# Altium schematic sheet Whitespace_Daughtercard_connector.SchDoc: Daughtercard HSMC Connector & Signals
size A2; Author: Ryan E. Guerra; Revision: 1.0; SheetNumber: 3; SheetTotal: 10
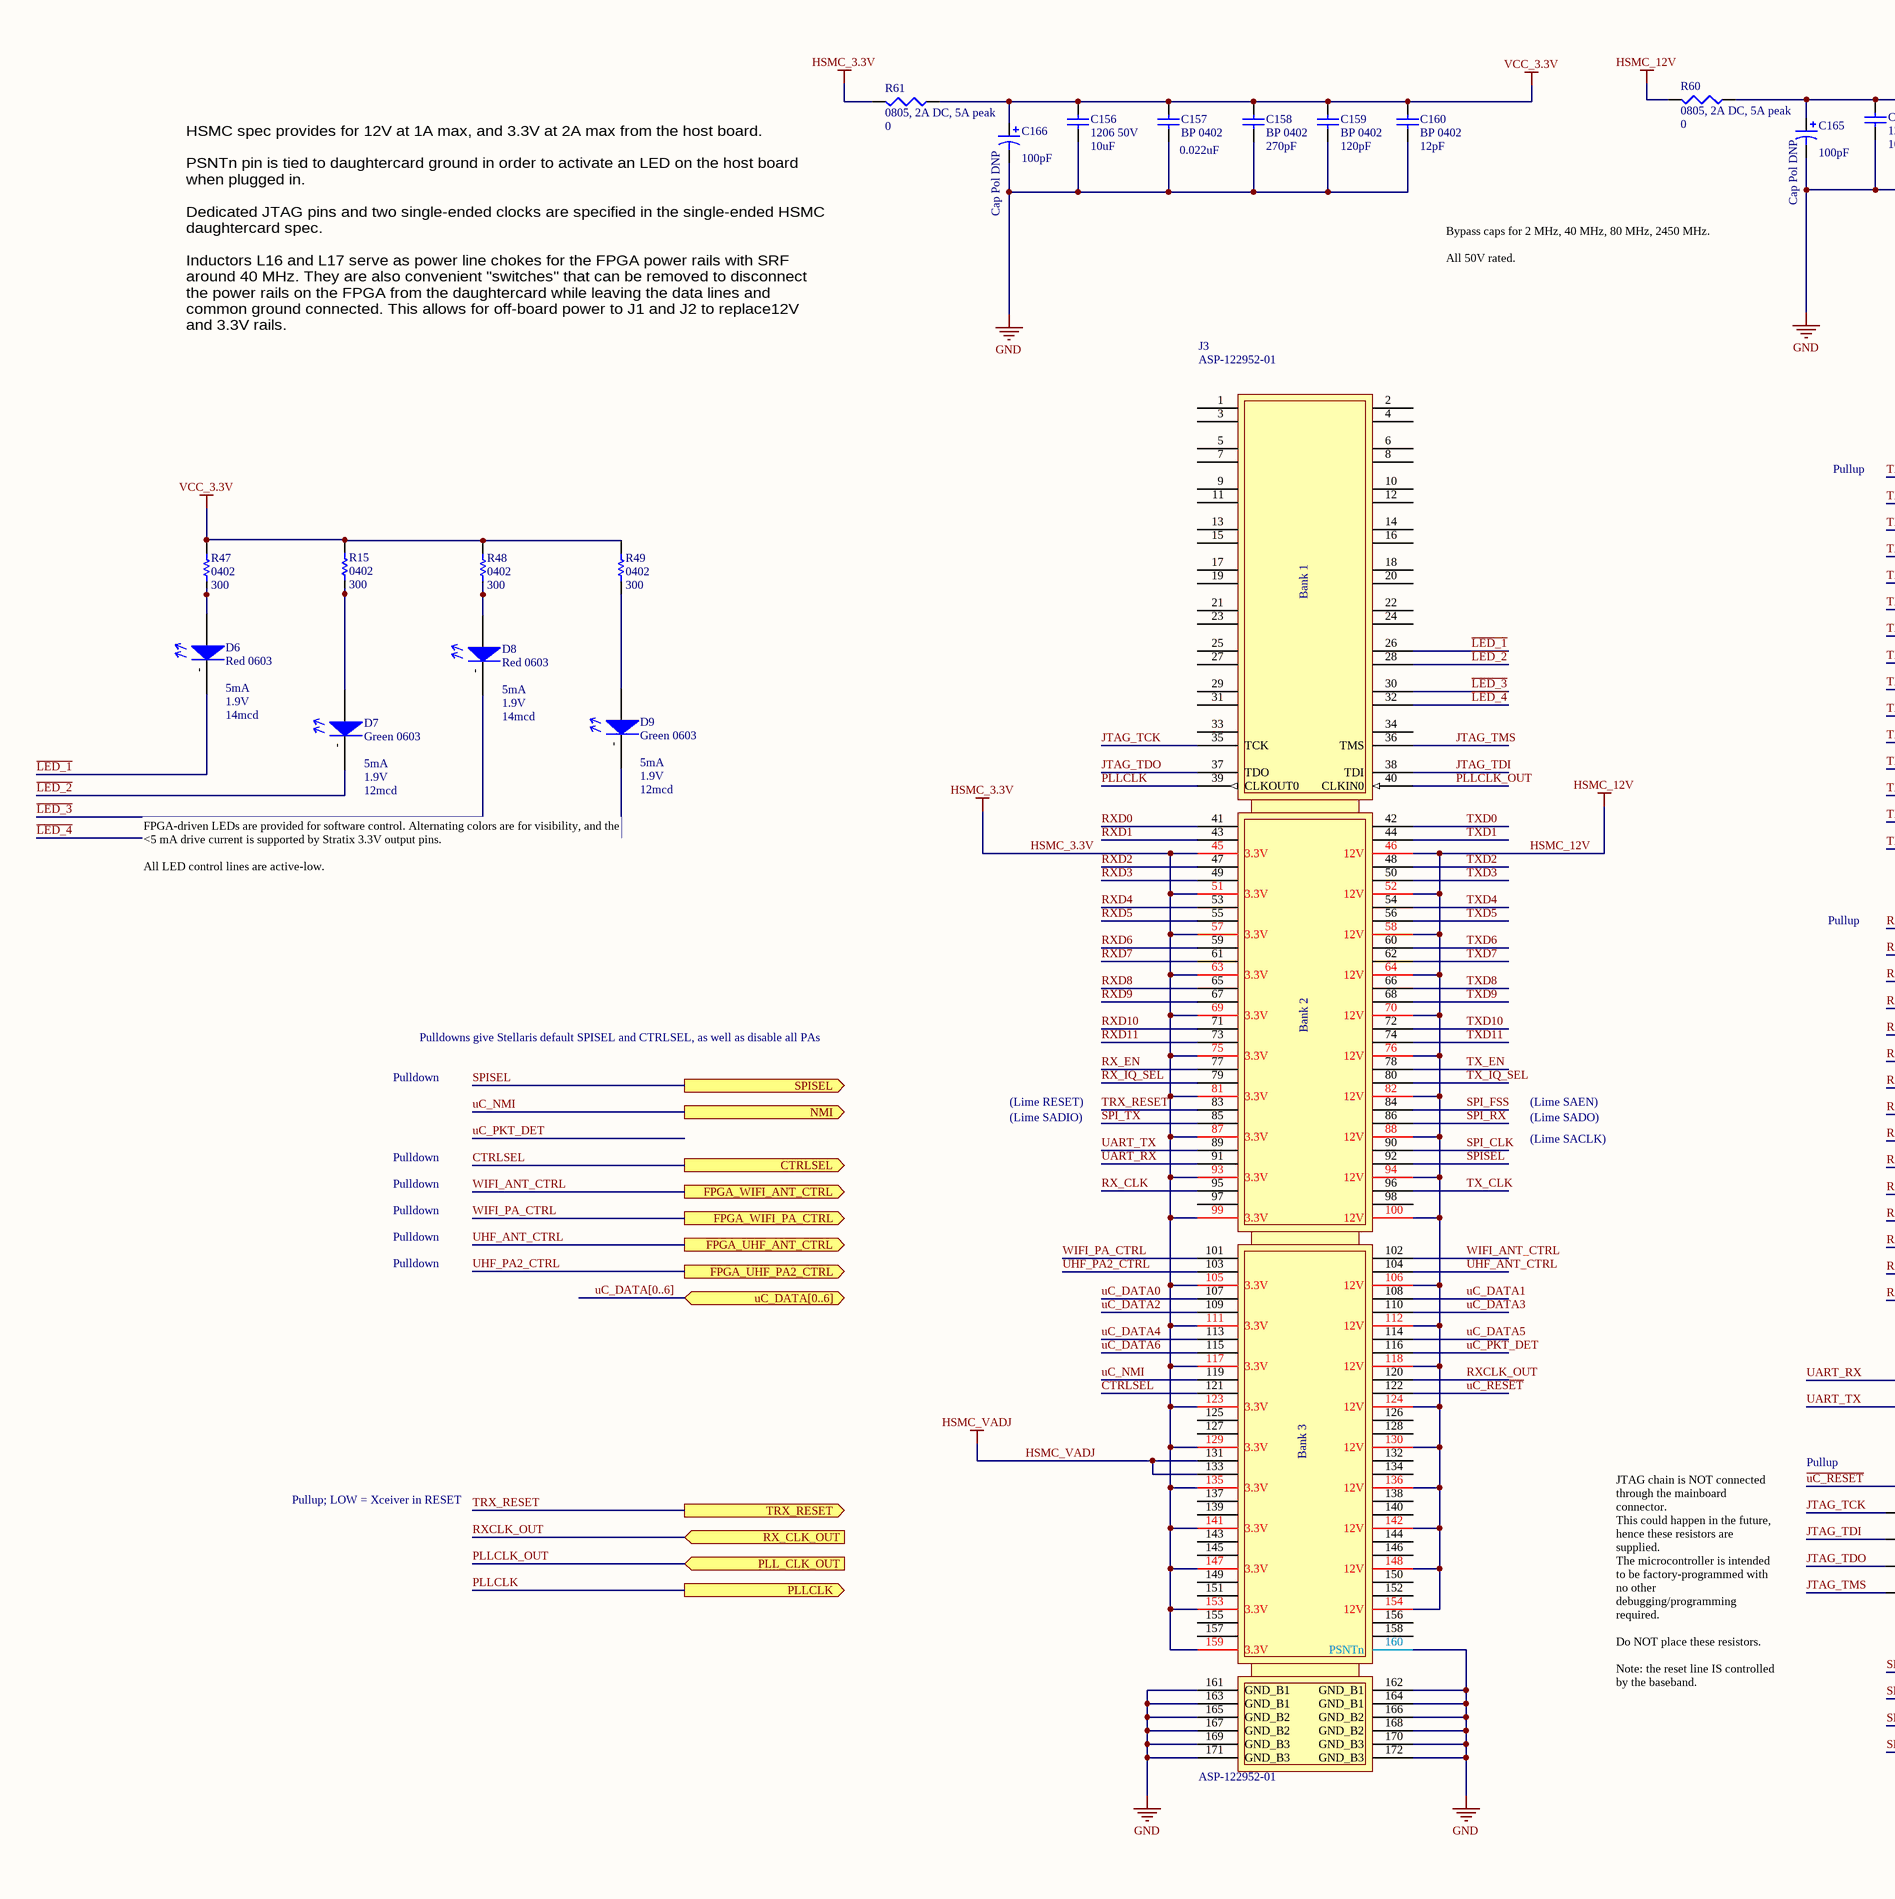
[diagram p0: Whitespace_Daughtercard_connector.SchDoc, left]
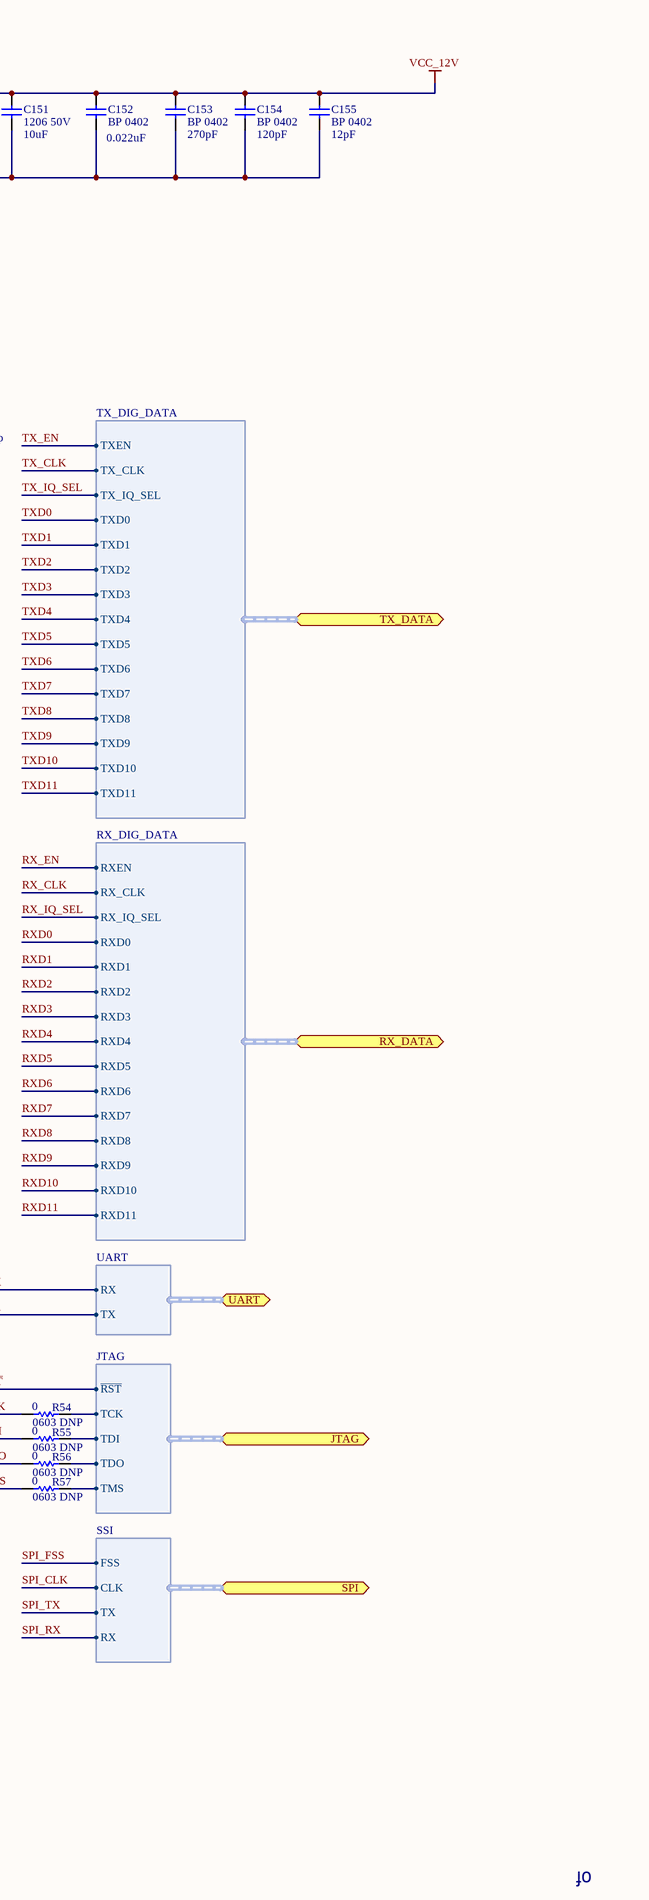
[diagram p1: Whitespace_Daughtercard_connector.SchDoc, right]

## Parts
C151  1206 50V  value 10uF  [1206_SMT_v3]
C152  BP 0402  value 0.022uF  [0402_SMT_V3]
C153  BP 0402  value 270pF  [0402_SMT_v3]
C154  BP 0402  value 120pF  [0402_SMT_v3]
C155  BP 0402  value 12pF  [0402_SMT_v3]
C156  1206 50V  value 10uF  [1206_SMT_v3]
C157  BP 0402  value 0.022uF  [0402_SMT_V3]
C158  BP 0402  value 270pF  [0402_SMT_v3]
C159  BP 0402  value 120pF  [0402_SMT_v3]
C160  BP 0402  value 12pF  [0402_SMT_v3]
C165  Cap Pol DNP  value 100pF  [PANASONIC_ELEC_CAP_G_v2]
C166  Cap Pol DNP  value 100pF  [PANASONIC_ELEC_CAP_G_v2]
D6  Red 0603  Current: 5mA  Forward Voltage Drop: 1.9V  Luminosity: 14mcd  [0603_POLAR]
D7  Green 0603  Current: 5mA  Forward Voltage: 1.9V  Luminosity: 12mcd  [0603_POLAR]
D8  Red 0603  Current: 5mA  Forward Voltage Drop: 1.9V  Luminosity: 14mcd  [0603_POLAR]
D9  Green 0603  Current: 5mA  Forward Voltage: 1.9V  Luminosity: 12mcd  [0603_POLAR]
J3  ASP-122952-01  [ASP-122952-01]
R15  0402  value 300  [0402_SMT_v3]
R47  0402  value 300  [0402_SMT_v3]
R48  0402  value 300  [0402_SMT_v3]
R49  0402  value 300  [0402_SMT_v3]
R54  0603 DNP  value 0  [0603_SMT_v3]
R55  0603 DNP  value 0  [0603_SMT_v3]
R56  0603 DNP  value 0  [0603_SMT_v3]
R57  0603 DNP  value 0  [0603_SMT_v3]
R60  0805, 2A DC, 5A peak  value 0  [0805_SMT_v3]
R61  0805, 2A DC, 5A peak  value 0  [0805_SMT_v3]

## Ports
CTRLSEL (out), FPGA_UHF_ANT_CTRL (out), FPGA_UHF_PA2_CTRL (out), FPGA_WIFI_ANT_CTRL (out), FPGA_WIFI_PA_CTRL (out), JTAG (harness JTAG), NMI (out), PLL_CLK_OUT (in), PLLCLK (out), RX_CLK_OUT (in), RX_DATA (harness RX_DIG_DATA), SPI (harness SSI), SPISEL (out), TRX_RESET (out), TX_DATA (harness TX_DIG_DATA), UART (harness UART), uC_DATA[0..6]

## Harnesses
JTAG: ~{RST}, TCK, TDI, TDO, TMS
RX_DIG_DATA: RXEN, RX_CLK, RX_IQ_SEL, RXD0, RXD1, RXD2, RXD3, RXD4, RXD5, RXD6, RXD7, RXD8, RXD9, RXD10, RXD11
TX_DIG_DATA: TXEN, TX_CLK, TX_IQ_SEL, TXD0, TXD1, TXD2, TXD3, TXD4, TXD5, TXD6, TXD7, TXD8, TXD9, TXD10, TXD11
SSI: FSS, CLK, TX, RX
UART: RX, TX

## Nets
GND: C151.1 C152.1 C153.2 C154.1 C155.2 C156.1 C157.1 C158.2 C159.1 C160.2 C165.2 C166.2 J3.160(PSNTn) J3.161(GND_B1) J3.162(GND_B1) J3.163(GND_B1) J3.164(GND_B1) J3.165(GND_B2) J3.166(GND_B2) J3.167(GND_B2) J3.168(GND_B2) J3.169(GND_B3) J3.170(GND_B3) J3.171(GND_B3) J3.172(GND_B3)
HSMC_3.3V: J3.45(3.3V) J3.51(3.3V) J3.57(3.3V) J3.63(3.3V) J3.69(3.3V) J3.75(3.3V) J3.81(3.3V) J3.87(3.3V) J3.93(3.3V) J3.99(3.3V) J3.105(3.3V) J3.111(3.3V) J3.117(3.3V) J3.123(3.3V) J3.129(3.3V) J3.135(3.3V) J3.141(3.3V) J3.147(3.3V) J3.153(3.3V) J3.159(3.3V) R61.2
HSMC_12V: J3.46(12V) J3.52(12V) J3.58(12V) J3.64(12V) J3.70(12V) J3.76(12V) J3.82(12V) J3.88(12V) J3.94(12V) J3.100(12V) J3.106(12V) J3.112(12V) J3.118(12V) J3.124(12V) J3.130(12V) J3.136(12V) J3.142(12V) J3.148(12V) J3.154(12V) R60.2
HSMC_VADJ: J3.131 J3.133
VCC_3.3V: C156.2 C157.2 C158.1 C159.2 C160.1 C166.1 R15.1 R47.1 R48.1 R49.1 R61.1
VCC_12V: C151.2 C152.2 C153.1 C154.2 C155.1 C165.1 R60.1
~{LED_1}: D6.-(Cathode) J3.26
~{LED_2}: D7.-(Cathode) J3.28
~{LED_3}: D8.-(Cathode) J3.30
~{LED_4}: D9.-(Cathode) J3.32
~{uC_RESET}: J3.122 ; port JTAG.~{RST}
CTRLSEL: J3.121 ; port CTRLSEL
JTAG_TCK: J3.35(TCK) R54.2
JTAG_TDI: J3.38(TDI) R55.2
JTAG_TDO: J3.37(TDO) R56.2
JTAG_TMS: J3.36(TMS) R57.2
PLLCLK: J3.39(CLKOUT0) ; port PLLCLK
PLLCLK_OUT: J3.40(CLKIN0) ; port PLL_CLK_OUT
RX_CLK: J3.95 ; port RX_DATA.RX_CLK
RX_EN: J3.77 ; port RX_DATA.RXEN
RX_IQ_SEL: J3.79 ; port RX_DATA.RX_IQ_SEL
RXCLK_OUT: J3.120 ; port RX_CLK_OUT
RXD0: J3.41 ; port RX_DATA.RXD0
RXD1: J3.43 ; port RX_DATA.RXD1
RXD2: J3.47 ; port RX_DATA.RXD2
RXD3: J3.49 ; port RX_DATA.RXD3
RXD4: J3.53 ; port RX_DATA.RXD4
RXD5: J3.55 ; port RX_DATA.RXD5
RXD6: J3.59 ; port RX_DATA.RXD6
RXD7: J3.61 ; port RX_DATA.RXD7
RXD8: J3.65 ; port RX_DATA.RXD8
RXD9: J3.67 ; port RX_DATA.RXD9
RXD10: J3.71 ; port RX_DATA.RXD10
RXD11: J3.73 ; port RX_DATA.RXD11
SPI_CLK: J3.90 ; port SPI.CLK
SPI_FSS: J3.84 ; port SPI.FSS
SPI_RX: J3.86 ; port SPI.RX
SPI_TX: J3.85 ; port SPI.TX
SPISEL: J3.92 ; port SPISEL
TRX_RESET: J3.83 ; port TRX_RESET
TX_CLK: J3.96 ; port TX_DATA.TX_CLK
TX_EN: J3.78 ; port TX_DATA.TXEN
TX_IQ_SEL: J3.80 ; port TX_DATA.TX_IQ_SEL
TXD0: J3.42 ; port TX_DATA.TXD0
TXD1: J3.44 ; port TX_DATA.TXD1
TXD2: J3.48 ; port TX_DATA.TXD2
TXD3: J3.50 ; port TX_DATA.TXD3
TXD4: J3.54 ; port TX_DATA.TXD4
TXD5: J3.56 ; port TX_DATA.TXD5
TXD6: J3.60 ; port TX_DATA.TXD6
TXD7: J3.62 ; port TX_DATA.TXD7
TXD8: J3.66 ; port TX_DATA.TXD8
TXD9: J3.68 ; port TX_DATA.TXD9
TXD10: J3.72 ; port TX_DATA.TXD10
TXD11: J3.74 ; port TX_DATA.TXD11
UART_RX: J3.91 ; port UART.RX
UART_TX: J3.89 ; port UART.TX
uC_DATA0: J3.107
uC_DATA1: J3.108
uC_DATA2: J3.109
uC_DATA3: J3.110
uC_DATA4: J3.113
uC_DATA5: J3.114
uC_DATA6: J3.115
uC_NMI: J3.119 ; port NMI
uC_PKT_DET: J3.116
UHF_ANT_CTRL: J3.104 ; port FPGA_UHF_ANT_CTRL
UHF_PA2_CTRL: J3.103 ; port FPGA_UHF_PA2_CTRL
WIFI_ANT_CTRL: J3.102 ; port FPGA_WIFI_ANT_CTRL
WIFI_PA_CTRL: J3.101 ; port FPGA_WIFI_PA_CTRL
NetD6_+: D6.+(Anode) R47.2
NetD7_+: D7.+(Anode) R15.2
NetD8_+: D8.+(Anode) R48.2
NetD9_+: D9.+(Anode) R49.2
NetR54_1: R54.1 ; port JTAG.TCK
NetR55_1: R55.1 ; port JTAG.TDI
NetR56_1: R56.1 ; port JTAG.TDO
NetR57_1: R57.1 ; port JTAG.TMS

Not connected (* = marked no-connect by the designer): J3 1 2 3 4 5 6 7 8 9 10 11 12 13 14 15 16 17 18 19 20 21 22 23 24 25 27 29 31 33(SDA) 34(SCL) 97 98 125 126 127 128 132 134 137 138 139 140 143 144 145 146 149 150 151 152 155 156 157 158

## Buses and harness runs
bus uC_DATA[0..6] = port uC_DATA[0..6]

## Notes on the sheet
- Bypass caps for 2 MHz, 40 MHz, 80 MHz, 2450 MHz.
  All 50V rated.
- HSMC spec provides for 12V at 1A max, and 3.3V at 2A max from the host board.
  PSNTn pin is tied to daughtercard ground in order to activate an LED on the host board when plugged in.
  Dedicated JTAG pins and two single-ended clocks are specified in the single-ended HSMC daughtercard spec.
  Inductors L16 and L17 serve as power line chokes for the FPGA power rails with SRF around 40 MHz. They are also convenient "switches" that can be removed to disconnect the power rails on the FPGA from the daughtercard while leaving the data lines and common ground connected. This allows for off-board power to J1 and J2 to replace12V and 3.3V rails.
- Pullup
- FPGA-driven LEDs are provided for software control. Alternating colors are for visibility, and the <5 mA drive current is supported by Stratix 3.3V output pins.
  All LED control lines are active-low.
- Pulldowns give Stellaris default SPISEL and CTRLSEL, as well as disable all PAs
- Pulldown
- (Lime RESET)
- (Lime SAEN)
- (Lime SADIO)
- (Lime SADO)
- (Lime SACLK)
- Pullup; LOW = Xceiver in RESET
- JTAG chain is NOT connected through the mainboard connector.
  This could happen in the future, hence these resistors are supplied.
  The microcontroller is intended to be factory-programmed with no other debugging/programming required.
  Do NOT place these resistors.
  Note: the reset line IS controlled by the baseband.
- of
- (in symbol ASP-122952-01) Bank 1; Bank 2; Bank 3

## Library data of the parts
C151-C160 = Cap: Capacitor; Published: 8-Jun-2000; LatestRevisionDate: 17-Jul-2002; LatestRevisionNote: Re-released for DXP Platform.; PackageReference: RAD-0.3; Publisher: Altium Limited; PackageDescription: Radial Cap, Thru-Hole; 2 Leads; 0.3 in Pin Spacing; Supplier 1: Mouser
  C151 C156: Supplier Part Number 1: 81-GRM31CR61H106KA2L
  C152 C157: Supplier Part Number 1: 81-GRM155R71H223KA2J
  C153 C158: Supplier Part Number 1: 81-GRM155C1H271JA01D
  C154 C159: Supplier Part Number 1: 81-GRM1555C1H121GA1D
  C155 C160: Supplier Part Number 1: 81-GRM1555C1H120GA1D
C165 C166 = Cap Pol3: Polarized Capacitor (Surface Mount); Published: 8-Jun-2000; LatestRevisionDate: 29-May-2009; LatestRevisionNote: IPC-7351 Footprint Added.; PackageReference: C0805; Publisher: Altium Limited; PackageDescription: Chip Capacitor; Supplier 1: Mouser; Supplier Part Number 1: 667-EEE-1HA101P
D6-D9 = LED: Supplier 1: Mouser
  D6 D8: Supplier Part Number 1: 859-LTSTC193KRKT5A
  D7 D9: Supplier Part Number 1: 859-LTSTC193KGKT5A
J3 = ASP-122952-01: Samtec HSMC Daughtercard Connector (Male)
R15 R47-R49 R54-R57 = Res Semi: Semiconductor Resistor; Published: 8-Jun-2000; LatestRevisionDate: 17-Jul-2002; LatestRevisionNote: Re-released for DXP Platform.; PackageReference: AXIAL-0.5; Publisher: Altium Limited; PackageDescription: Axial Device, Thru-Hole; 2 Leads; 0.5 in Pin Spacing; Supplier 1: Mouser
  R15 R47-R49: Supplier Part Number 1: 660-RK73B1ETTP301J
  R54-R57: Supplier Part Number 1: 660-RK73Z1JTTDD
R60 R61 = Res3: Resistor; Published: 8-Jun-2000; LatestRevisionDate: 29-May-2009; LatestRevisionNote: IPC-7351 Footprint Added.; PackageReference: J1-0603; Publisher: Altium Limited; PackageDescription: Chip Resistor; Supplier 1: Mouser; Supplier Part Number 1: 660-RK73Z2ATTED